# EAGLE schematic new_stuff (EAGLE 4.15)
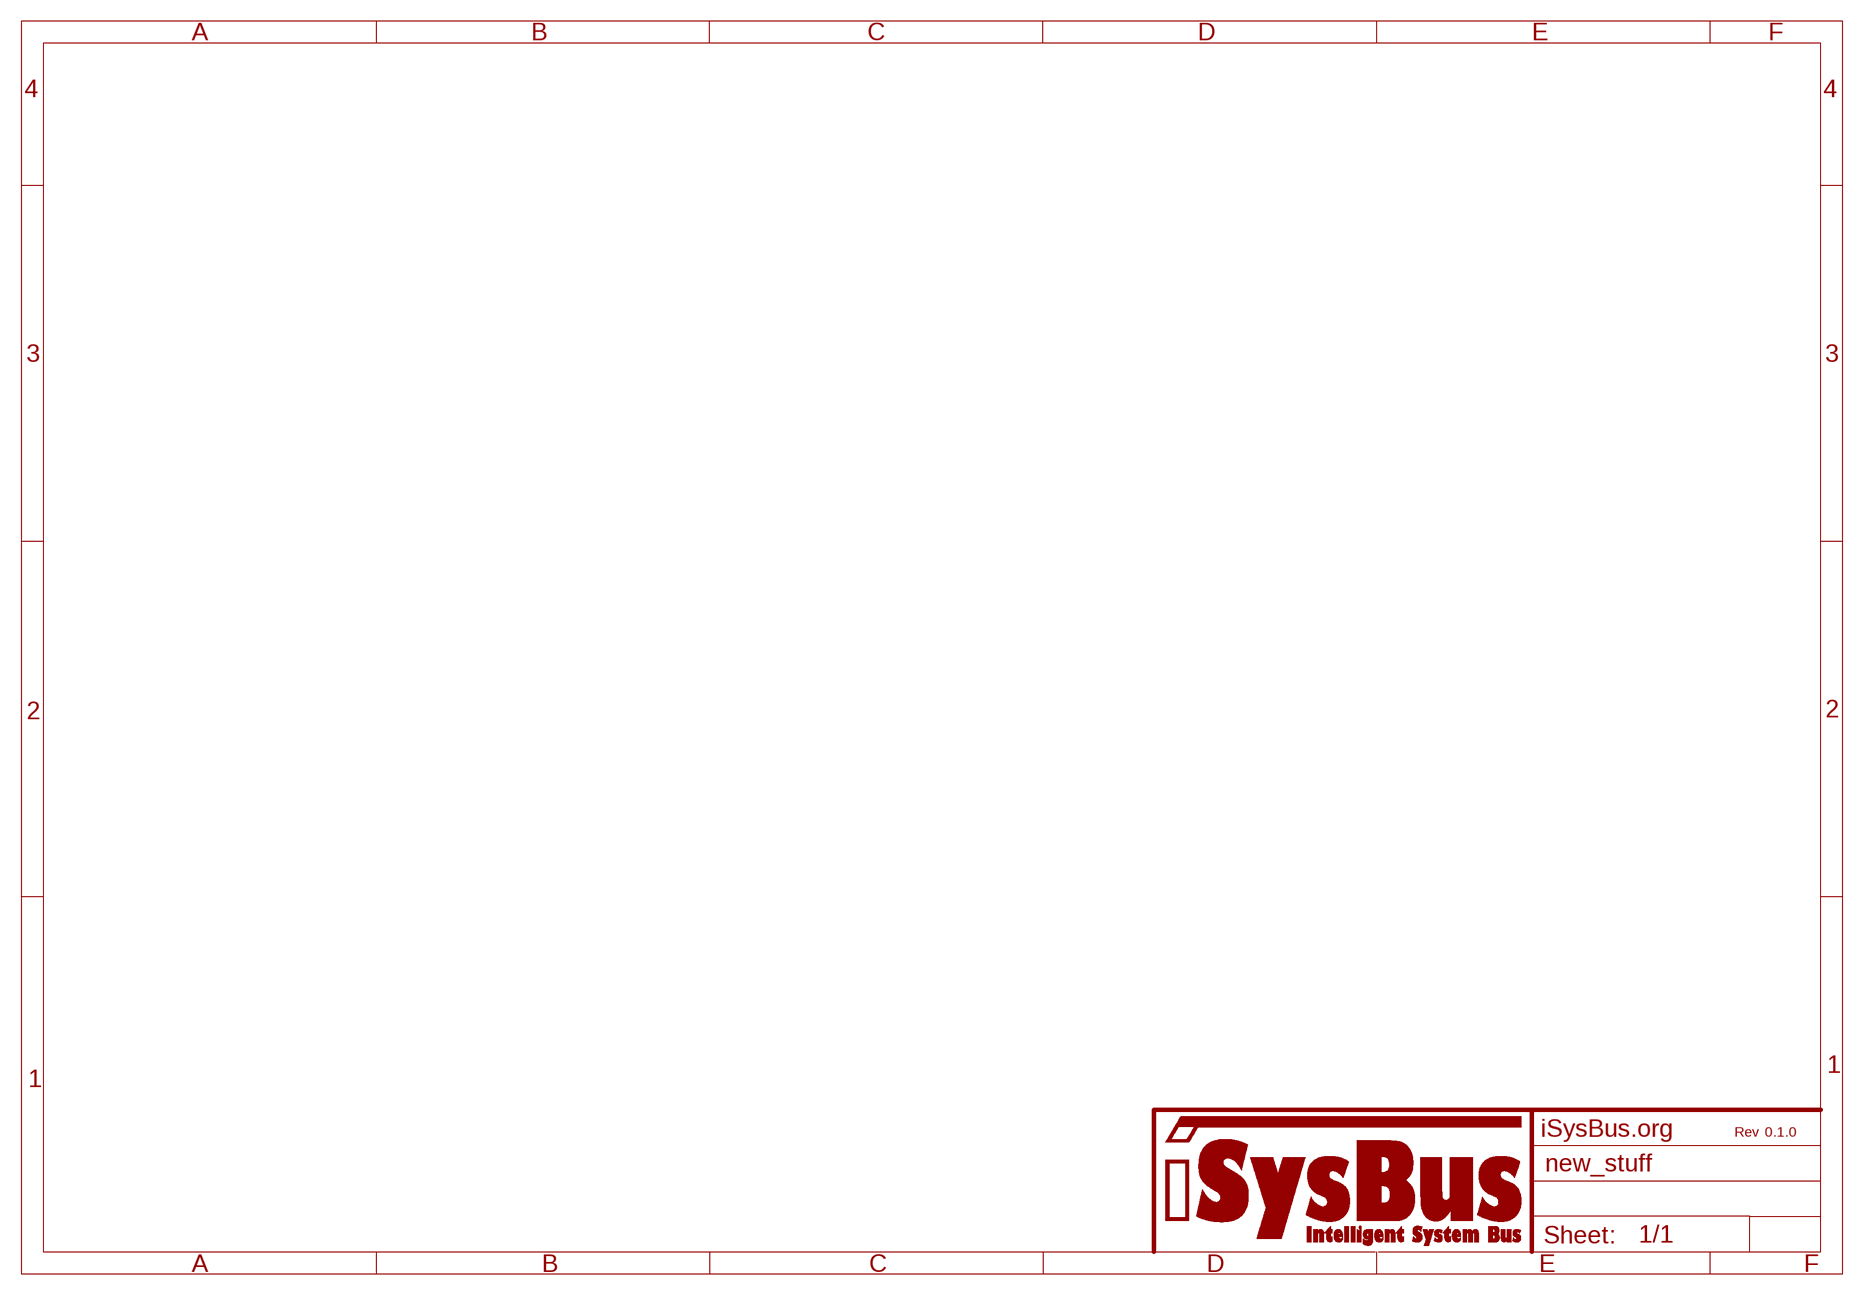
[diagram p0: schematic, sheet 1]

## Parts
U$1  ISYSBUS_LOGO  [ISYSBUS_LOGO]
U$2  0.1.0  REVISION_FIELD  [REVISION_FIELD]

## Library data of the parts
U$1 = hausbus:ISYSBUS_LOGO
U$2 = hausbus:REVISION_FIELD